# EAGLE design bbf-supply (EAGLE 9.6.2)
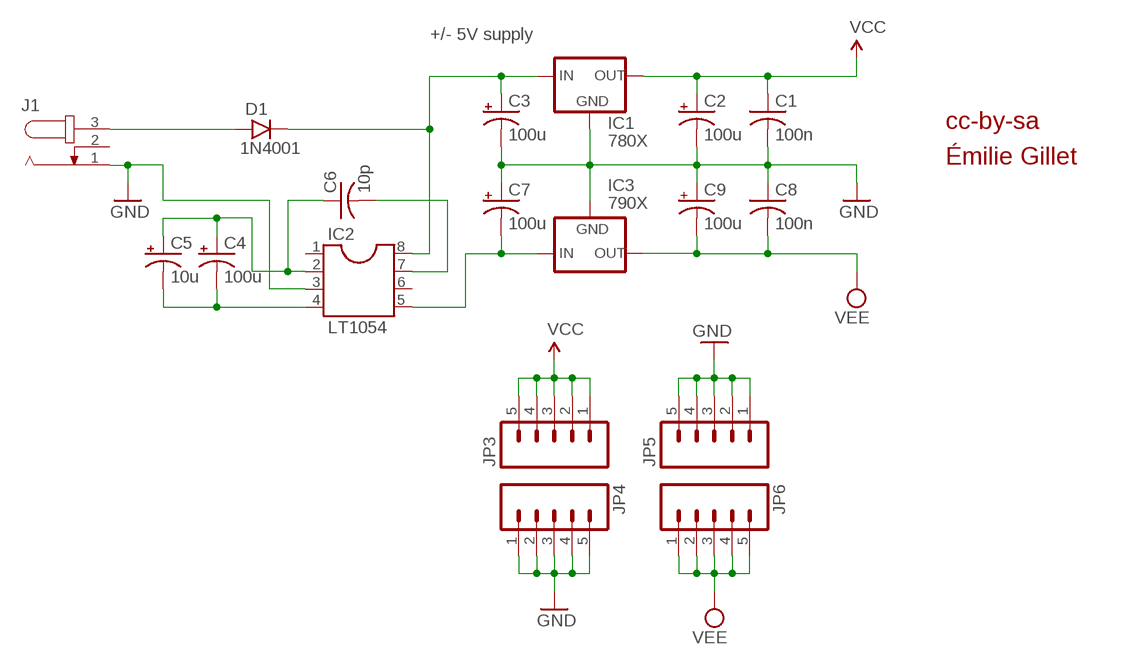
[diagram p0: schematic, sheet 1]

## Parts
C1  100n  C-US025-025X050  [C025-025X050]
C2  100u  CPOL-USE2.5-7  [E2,5-7]
C3  100u  CPOL-USE2.5-7  [E2,5-7]
C4  100u  CPOL-USE2.5-6  [E2,5-6]
C5  10u  CPOL-USE2.5-5  [E2,5-5]
C6  10p  C-US025-025X050  [C025-025X050]
C7  100u  CPOL-USE2.5-7  [E2,5-7]
C8  100n  C-US025-025X050  [C025-025X050]
C9  100u  CPOL-USE2.5-7  [E2,5-7]
D1  1N4001  1N400X.3  [DO41-3]
IC1  780X  78XXS  [78XXS]
IC2  LT1054  DIL8  [DIL08]
IC3  790X  79XXS  [79XXS]
J1  JACK-PLUG2  [SPC4078_BIG_HOLES]
JP3  M05PTH  [1X05]
JP4  M05PTH  [1X05]
JP5  M05PTH  [1X05]
JP6  M05PTH  [1X05]

## Nets
GND: C1.2 C2.- C3.- C7.+ C8.1 C9.+ IC1.GND IC2.3 IC3.GND J1.1 JP4.1 JP4.2 JP4.3 JP4.4 JP4.5 JP5.1 JP5.2 JP5.3 JP5.4 JP5.5
N$44: D1.A J1.3
N$46: C3.+ D1.C IC1.IN IC2.8
N$47: C4.+ C5.+ C6.1 IC2.2
N$48: C4.- C5.- IC2.4
N$49: C6.2 IC2.7
N$58: C7.- IC2.5 IC3.IN
VCC: C1.1 C2.+ IC1.OUT JP3.1 JP3.2 JP3.3 JP3.4 JP3.5
VEE: C8.2 C9.- IC3.OUT JP6.1 JP6.2 JP6.3 JP6.4 JP6.5
Unconnected: IC2.1 IC2.6 J1.2

## Notes on the sheet
- +/- 5V supply
- cc-by-sa
- Émilie Gillet

## Library data of the parts
C1 C6 C8 = rcl:C-US: CAPACITOR, American symbol
C2-C5 C7 C9 = rcl:CPOL-US: POLARIZED CAPACITOR, American symbol
D1 = gm-diodes:1N400X: Rectifier Diodes often used in power supply to prevent damage from reverse polarization
IC1 = v-reg:78XXS: VOLTAGE REGULATOR
IC2 = ic-package:DIL8: Dual In Line / Socket
IC3 = v-reg:79XXS: VOLTAGE REGULATOR
J1 = con-jack2:JACK-PLUG: DC POWER JACK Power Jack, DC, Right Angle, Through Hole, Rated 5A at 16VDC, PC Terminals Distributor: Farnell (www.Farnell.de) Drawing: 84N1161.pdf / 84N1162.pdf Manufacturer: SPC Technology (www.spctechnology.com) Type: SPC4077 / SPC 4078
JP3-JP6 = SparkFun:M05: Header 5 Standard 5-pin 0.1" header. Use with straight break away headers (SKU : PRT-00116), right angle break away headers (PRT-00553), swiss pins (PRT-00743), machine pins (PRT-00117), and female headers (PRT-00115). Molex polarized connector foot print use with SKU : PRT-08230 with associated crimp pins and housings.

## Board
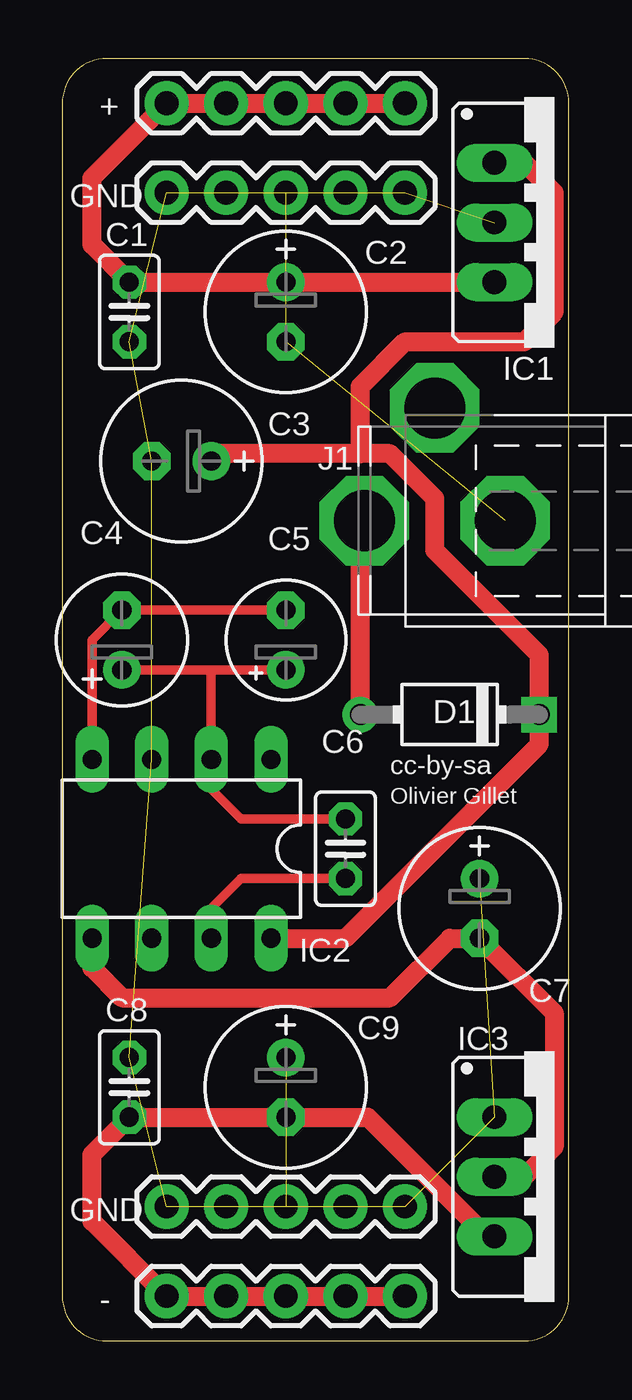
[diagram p1: board, top side]
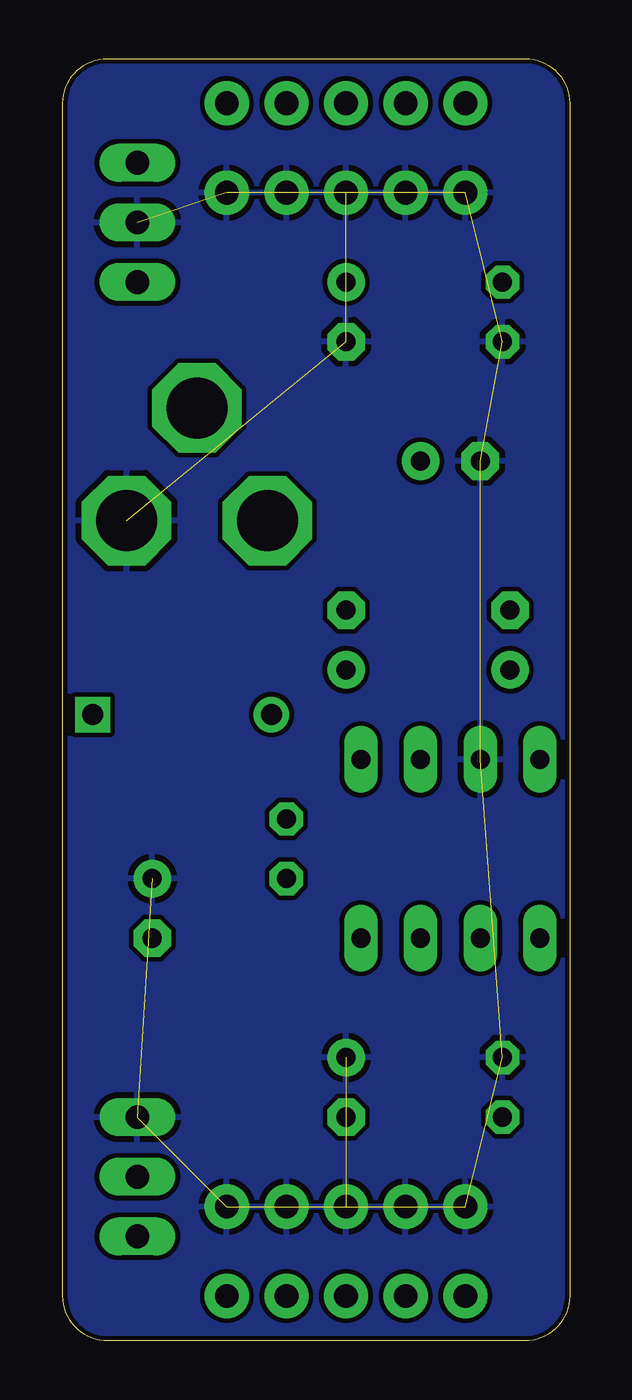
[diagram p2: board, bottom side, seen from below]

Size 21.59 x 54.6 mm. Coordinates in mm from the lower left corner, seen from the top.
Outline: 1.89,54.6 arc90 0,52.7 0,1.91 arc90 1.9,0 19.69,0 arc90 21.59,1.91 21.59,52.7 arc90 19.7,54.6 1.89,54.6
Copper layers (1*16): Top 0.035mm / dielectric 1.5mm / Bottom 0.035mm
Design rules "SparkFun_10mil *": minimum track width 8mil, minimum drill 20mil, track to track 8mil, track to pad 8mil, pad to pad 8mil, via to via 8mil, smd to smd 8mil, copper to edge 8mil, drill to drill 8mil, minimum pad ring 12mil, minimum via ring 10mil, stop-mask expansion 4mil, vias tented up to drill 25mil, thermal gap 10mil

### Footprints (pad centres in the part's own frame; a part is rotated, then mirrored left to right if it is on the bottom)
C025-025X050 = drill 0.813 octagon: 1 -1.27,0; 2 1.27,0
E2,5-7 = drill 0.813 pad 1.6: + -1.27,0 | drill 0.813 pad 1.6 octagon: - 1.27,0
E2,5-6 = drill 0.813 pad 1.6: + -1.27,0 | drill 0.813 pad 1.6 octagon: - 1.27,0
E2,5-5 = drill 0.813 pad 1.6: + -1.27,0 | drill 0.813 pad 1.6 octagon: - 1.27,0
DO41-3 = drill 0.9: A 3.81,0 | drill 0.9 square: C -3.81,0
78XXS = drill 1.016 long: GND 0,-2.54; IN -2.54,-2.54; OUT 2.54,-2.54
DIL08 = drill 0.813 long: 1 -3.81,-3.81; 2 -1.27,-3.81; 3 1.27,-3.81; 4 3.81,-3.81; 5 3.81,3.81; 6 1.27,3.81; 7 -1.27,3.81; 8 -3.81,3.81
79XXS = drill 1.016 long: GND -2.54,-2.54; IN 0,-2.54; OUT 2.54,-2.54
SPC4078_BIG_HOLES = drill 2.6 pad 3.81 octagon: 1 -0.46,0; 2 2.54,-4.8; 3 5.54,0
1X05 = drill 1.016 pad 1.88: 1 0,0; 2 2.54,0; 3 5.08,0; 4 7.62,0; 5 10.16,0

### Placement (x,y rotation side)
C1  2.86,43.81 270 top
C2  9.53,43.81 270 top
C3  5.08,37.47 180 top
C4  2.54,29.85 90 top
C5  9.53,29.85 90 top
C6  12.06,20.96 270 top
C7  17.78,18.41 270 top
C8  2.86,10.8 270 top
C9  9.53,10.8 270 top
D1  16.51,26.67 180 top
IC1  20.95,47.62 270 top
IC2  5.08,20.96 180 top
IC3  20.95,6.98 270 top
J1  18.41,34.92 180 top
JP3  4.44,52.7 0 top
JP4  4.44,48.89 0 top
JP5  4.44,5.71 0 top
JP6  4.44,1.91 0 top

### Tracks (layer width: path | path; a pad name or v marks a point on that pad's centre or on a via)
GND  (19 unrouted)
  pour Bottom: 1.9,54.61 arc90 0,52.7 0,1.91 arc90 1.9,0 19.69,0 arc90 21.59,1.91 21.59,52.7 arc90 19.69,54.61
N$44
  Top 0.813: D1.A 12.7,33.66 12.87,33.83 J1.3
N$46
  Top 0.813: 12.7,37.78 6.67,37.78 C3.+ | 12.7,37.78 13.97,37.78 15.87,35.88 15.87,33.66 20.32,29.21 D1.C 20.32,25.4 12.06,17.14 IC2.8 | IC1.IN 19.69,50.17 20.95,48.89 20.95,43.81 19.69,42.55 14.6,42.55 12.7,40.64 12.7,37.78
N$47
  Top 0.406: 6.35,28.57 C4.+ | 6.35,28.57 C5.+ | 6.35,28.57 IC2.2 6.35,23.5 7.62,22.23 C6.1
N$48
  Top 0.406: C5.- C4.- 1.27,29.85 IC2.4
N$49
  Top 0.406: IC2.7 6.35,18.41 7.62,19.68 C6.2
N$58
  Top 0.813: IC2.5 1.27,15.88 2.54,14.61 13.97,14.61 16.51,17.14 C7.- 20.95,13.97 20.95,8.26 19.69,6.98 IC3.IN
VCC
  Top 0.813: IC1.OUT C2.+ C1.1 1.27,46.67 1.27,49.53 JP3.1 JP3.2 JP3.3 JP3.4 JP3.5
VEE
  Top 0.813: IC3.OUT 18.1,4.45 13.02,9.53 C9.- C8.2 1.27,7.94 1.27,5.08 JP6.1 JP6.2 JP6.3 JP6.4 JP6.5

### Text on the board
tNames: + | GND | cc-by-sa | Olivier Gillet | GND | -